# EAGLE design Testeur_new (EAGLE 6.1)
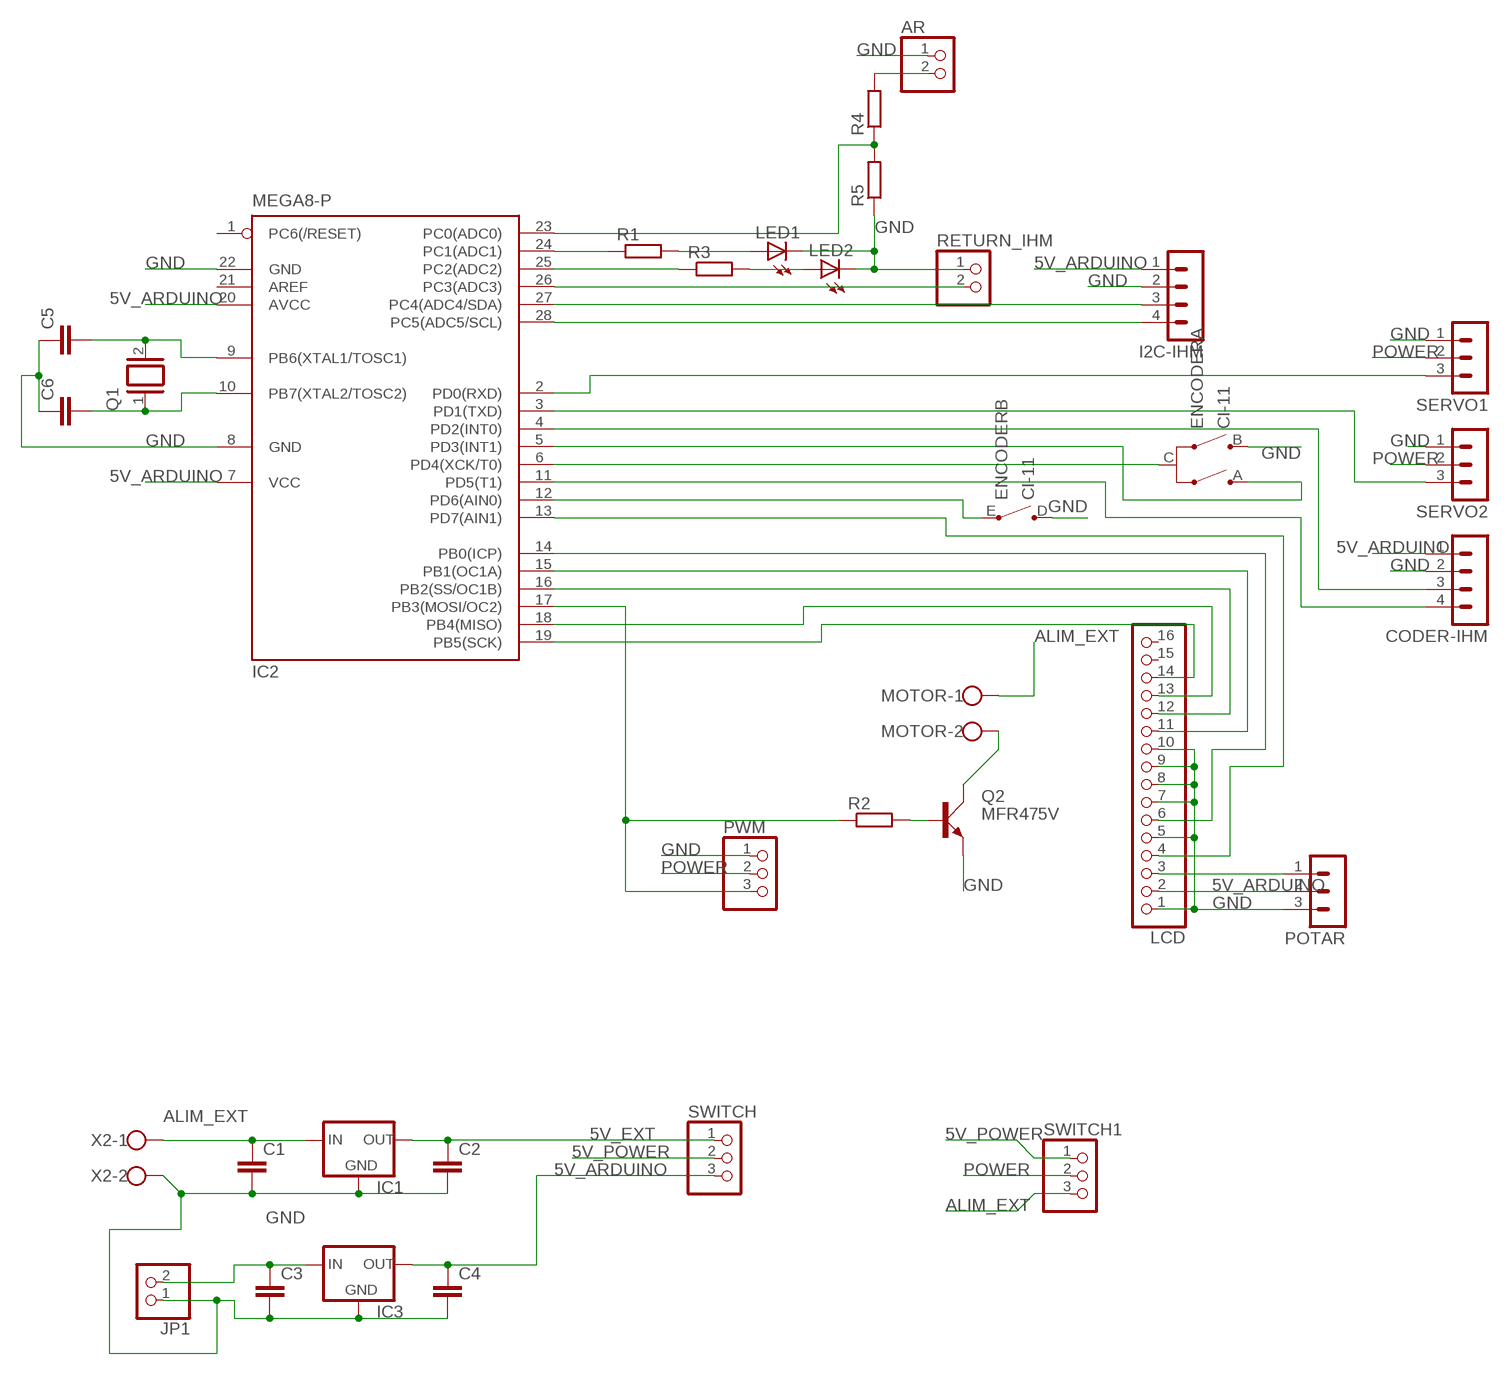
[diagram p0: schematic, sheet 1]

## Parts
AR  PINHD-1X2  [1X02]
C1  C5/3.5  [C5B3.5]
C2  C5/3.5  [C5B3.5]
C3  C5/3.5  [C5B3.5]
C4  C5/3.5  [C5B3.5]
C5  C5/5  [C5B5]
C6  C5/5  [C5B5]
CODER-IHM  MA04-1  [MA04-1]
ENCODER  CI-11  [CI-11]
I2C-IHM  MA04-1  [MA04-1]
IC1  78XXS  [78XXS]
IC2  MEGA8-P  [DIL28-3]
IC3  78XXS  [78XXS]
JP1  PINHD-1X2  [1X02]
LCD  PINHD-1X16  [1X16]
LED1  LED5MM  [LED5MM]
LED2  LED5MM  [LED5MM]
MOTOR  W237-102  [W237-102]
POTAR  MA03-1  [MA03-1]
PWM  PINHD-1X3  [1X03]
Q1  XTAL/S  [QS]
Q2  MFR475V  [TO220AV]
R1  R-EU_0204/7  [0204/7]
R2  R-EU_0204/7  [0204/7]
R3  R-EU_0204/7  [0204/7]
R4  R-EU_0204/7  [0204/7]
R5  R-EU_0204/7  [0204/7]
RETURN_IHM  PINHD-1X2  [1X02]
SERVO1  MA03-1  [MA03-1]
SERVO2  MA03-1  [MA03-1]
SWITCH  PINHD-1X3  [1X03]
SWITCH1  PINHD-1X3  [1X03]
X2  W237-102  [W237-102]

## Nets
5V_ARDUINO: C4.1 CODER-IHM.1 I2C-IHM.1 IC2.7(VCC) IC2.20(AVCC) IC3.OUT LCD.2 POTAR.2 SWITCH.3
5V_EXT: C2.1 IC1.OUT SWITCH.1
5V_POWER: SWITCH1.1 SWITCH.2
ALIM_EXT: C1.1 IC1.IN MOTOR.1 SWITCH1.3 X2.1
GND: AR.1 C1.2 C2.2 C3.2 C4.2 C5.1 C6.1 CODER-IHM.2 ENCODER.B(A:B) ENCODER.D(B:D) I2C-IHM.2 IC1.GND IC2.8(GND) IC2.22(GND) IC3.GND JP1.1 LCD.1 LCD.5 LCD.7 LCD.8 LCD.9 LCD.10 LED1.K(C) LED2.K(C) POTAR.3 PWM.1 Q2.E R5.1 RETURN_IHM.1 SERVO1.1 SERVO2.1 X2.2
N$1: IC2.26(PC3(ADC3)) RETURN_IHM.2
N$2: IC2.15(PB1(OC1A)) LCD.11
N$3: IC2.16(PB2(SS/OC1B)) LCD.12
N$4: IC2.18(PB4(MISO)) LCD.13
N$5: ENCODER.C(A:C) IC2.6(PD4(XCK/T0))
N$6: IC2.19(PB5(SCK)) LCD.14
N$8: Q2.B R2.2
N$9: LED2.A R3.2
N$10: I2C-IHM.3 IC2.27(PC4(ADC4/SDA))
N$11: I2C-IHM.4 IC2.28(PC5(ADC5/SCL))
N$12: LED1.A R1.2
N$13: ENCODER.E(B:E) IC2.12(PD6(AIN0))
N$14: IC2.2(PD0(RXD)) SERVO1.3
N$15: C3.1 IC3.IN JP1.2
N$16: CODER-IHM.3 IC2.4(PD2(INT0))
N$17: CODER-IHM.4 IC2.11(PD5(T1))
N$18: ENCODER.A(A:A) IC2.5(PD3(INT1))
N$21: IC2.24(PC1(ADC1)) R1.1
N$22: IC2.25(PC2(ADC2)) R3.1
N$24: AR.2 R4.2
N$25: IC2.13(PD7(AIN1)) LCD.4
N$26: IC2.14(PB0(ICP)) LCD.6
N$27: C6.2 IC2.10(PB7(XTAL2/TOSC2)) Q1.1
N$28: C5.2 IC2.9(PB6(XTAL1/TOSC1)) Q1.2
N$30: IC2.17(PB3(MOSI/OC2)) PWM.3 R2.1
N$37: R4.1 R5.2
N$39: LCD.3 POTAR.1
N$40: MOTOR.2 Q2.C
N$42: IC2.3(PD1(TXD)) SERVO2.3
POWER: PWM.2 SERVO1.2 SERVO2.2 SWITCH1.2
Unconnected: IC2.1(PC6(/RESET)) IC2.21(AREF) IC2.23(PC0(ADC0)) LCD.15 LCD.16

## Library data of the parts
AR JP1 RETURN_IHM = pinhead:PINHD-1X2: PIN HEADER
C1-C6 = capacitor-wima:C: CAPACITOR naming: grid - package width
CODER-IHM I2C-IHM = con-lstb:MA04-1: PIN HEADER; OC_FARNELL: unknown; OC_NEWARK: unknown
ENCODER = piher:CI-11: 11mm Incemental Encoder Source: www.piher.net .. 04-CI-11v04.pdf; OC_FARNELL: unknown; OC_NEWARK: unknown
IC1 IC3 = v-reg:78XXS: VOLTAGE REGULATOR
IC2 = atmel:MEGA8-P: MICROCONTROLLER 8 Kbytes FLASH, 1 kbytes SRAM, 512 bytes EEPROM, USART, 4-channel 10 bit ADC, 2-channel 8 bit ADC Pin compatible with Atmega48, ATMega88, ATMega168 Source: avr.lbr; OC_FARNELL: unknown; OC_NEWARK: unknown
LCD = pinhead:PINHD-1X16: PIN HEADER
LED1 LED2 = led:LED: LED OSRAM: - CHIPLED LG R971, LG N971, LY N971, LG Q971, LY Q971, LO R971, LY R971 LH N974, LH R974 LS Q976, LO Q976, LY Q976 LO Q996 - Hyper CHIPLED LW Q18S LB Q993, LB Q99A, LB R99A - SideLED LS A670, LO A670, LY A670, LG A670, LP A670 LB A673, LV A673, LT A673, LW A673 LH A674 LY A675 LS A676, LA A676, LO A676, LY A676, LW A676 LS A679, LY A679, LG A679 - Hyper Micro SIDELED® LS Y876, LA Y876, LO Y876, LY Y876 LT Y87S - SmartLED LW L88C, LW L88S LB L89C, LB L89S, LG L890 LS L89K, LO L89K, LY L89K LS L896, LA L896, LO L896, LY L896 - TOPLED LS T670, LO T670, LY T670, LG T670, LP T670 LSG T670, LSP T670, LSY T670, LOP T670, LYG T670 LG T671, LOG T671, LSG T671 LB T673, LV T673, LT T673, LW T673 LH T674 LS T676, LA T676, LO T676, LY T676, LB T676, LH T676, LSB T676, LW T676 LB T67C, LV T67C, LT T67C, LS T67K, LO T67K, LY T67K, LW E67C LS E67B, LA E67B, LO E67B, LY E67B, LB E67C, LV E67C, LT E67C LW T67C LS T679, LY T679, LG T679 LS T770, LO T770, LY T770, LG T770, LP T770 LB T773, LV T773, LT T773, LW T773 LH T774 LS E675, LA E675, LY E675, LS T675 LS T776, LA T776, LO T776, LY T776, LB T776 LHGB T686 LT T68C, LB T68C - Hyper Mini TOPLED® LB M676 - Mini TOPLED Santana® LG M470 LS M47K, LO M47K, LY M47K Source: http://www.osram.convergy.de LUXEON: - LUMILED® LXK2-PW12-R00, LXK2-PW12-S00, LXK2-PW14-U00, LXK2-PW14-V00 LXK2-PM12-R00, LXK2-PM12-S00, LXK2-PM14-U00 LXK2-PE12-Q00, LXK2-PE12-R00, LXK2-PE12-S00, LXK2-PE14-T00, LXK2-PE14-U00 LXK2-PB12-K00, LXK2-PB12-L00, LXK2-PB12-M00, LXK2-PB14-N00, LXK2-PB14-P00, LXK2-PB14-Q00 LXK2-PR12-L00, LXK2-PR12-M00, LXK2-PR14-Q00, LXK2-PR14-R00 LXK2-PD12-Q00, LXK2-PD12-R00, LXK2-PD12-S00 LXK2-PH12-R00, LXK2-PH12-S00 LXK2-PL12-P00, LXK2-PL12-Q00, LXK2-PL12-R00 Source: www.luxeon.com KINGBRIGHT: KA-3528ASYC Source: www.kingbright.com
MOTOR X2 = con-wago-500:W237-102: WAGO SCREW CLAMP; MPN: 237-102; OC_FARNELL: unknown; OC_NEWARK: 70K9898
POTAR SERVO1 SERVO2 = con-lstb:MA03-1: PIN HEADER; OC_FARNELL: unknown; OC_NEWARK: unknown
PWM SWITCH SWITCH1 = pinhead:PINHD-1X3: PIN HEADER
Q1 = special:XTAL/S: CRYSTAL
Q2 = transistor-power:MFR4*: NPN RF Power Transistor Source: Motorola - MRF475.pdf
R1 R3-R5 = rcl:R-EU_: RESISTOR, European symbol
R2 = resistor:R-EU_: RESISTOR, European symbol

## Board
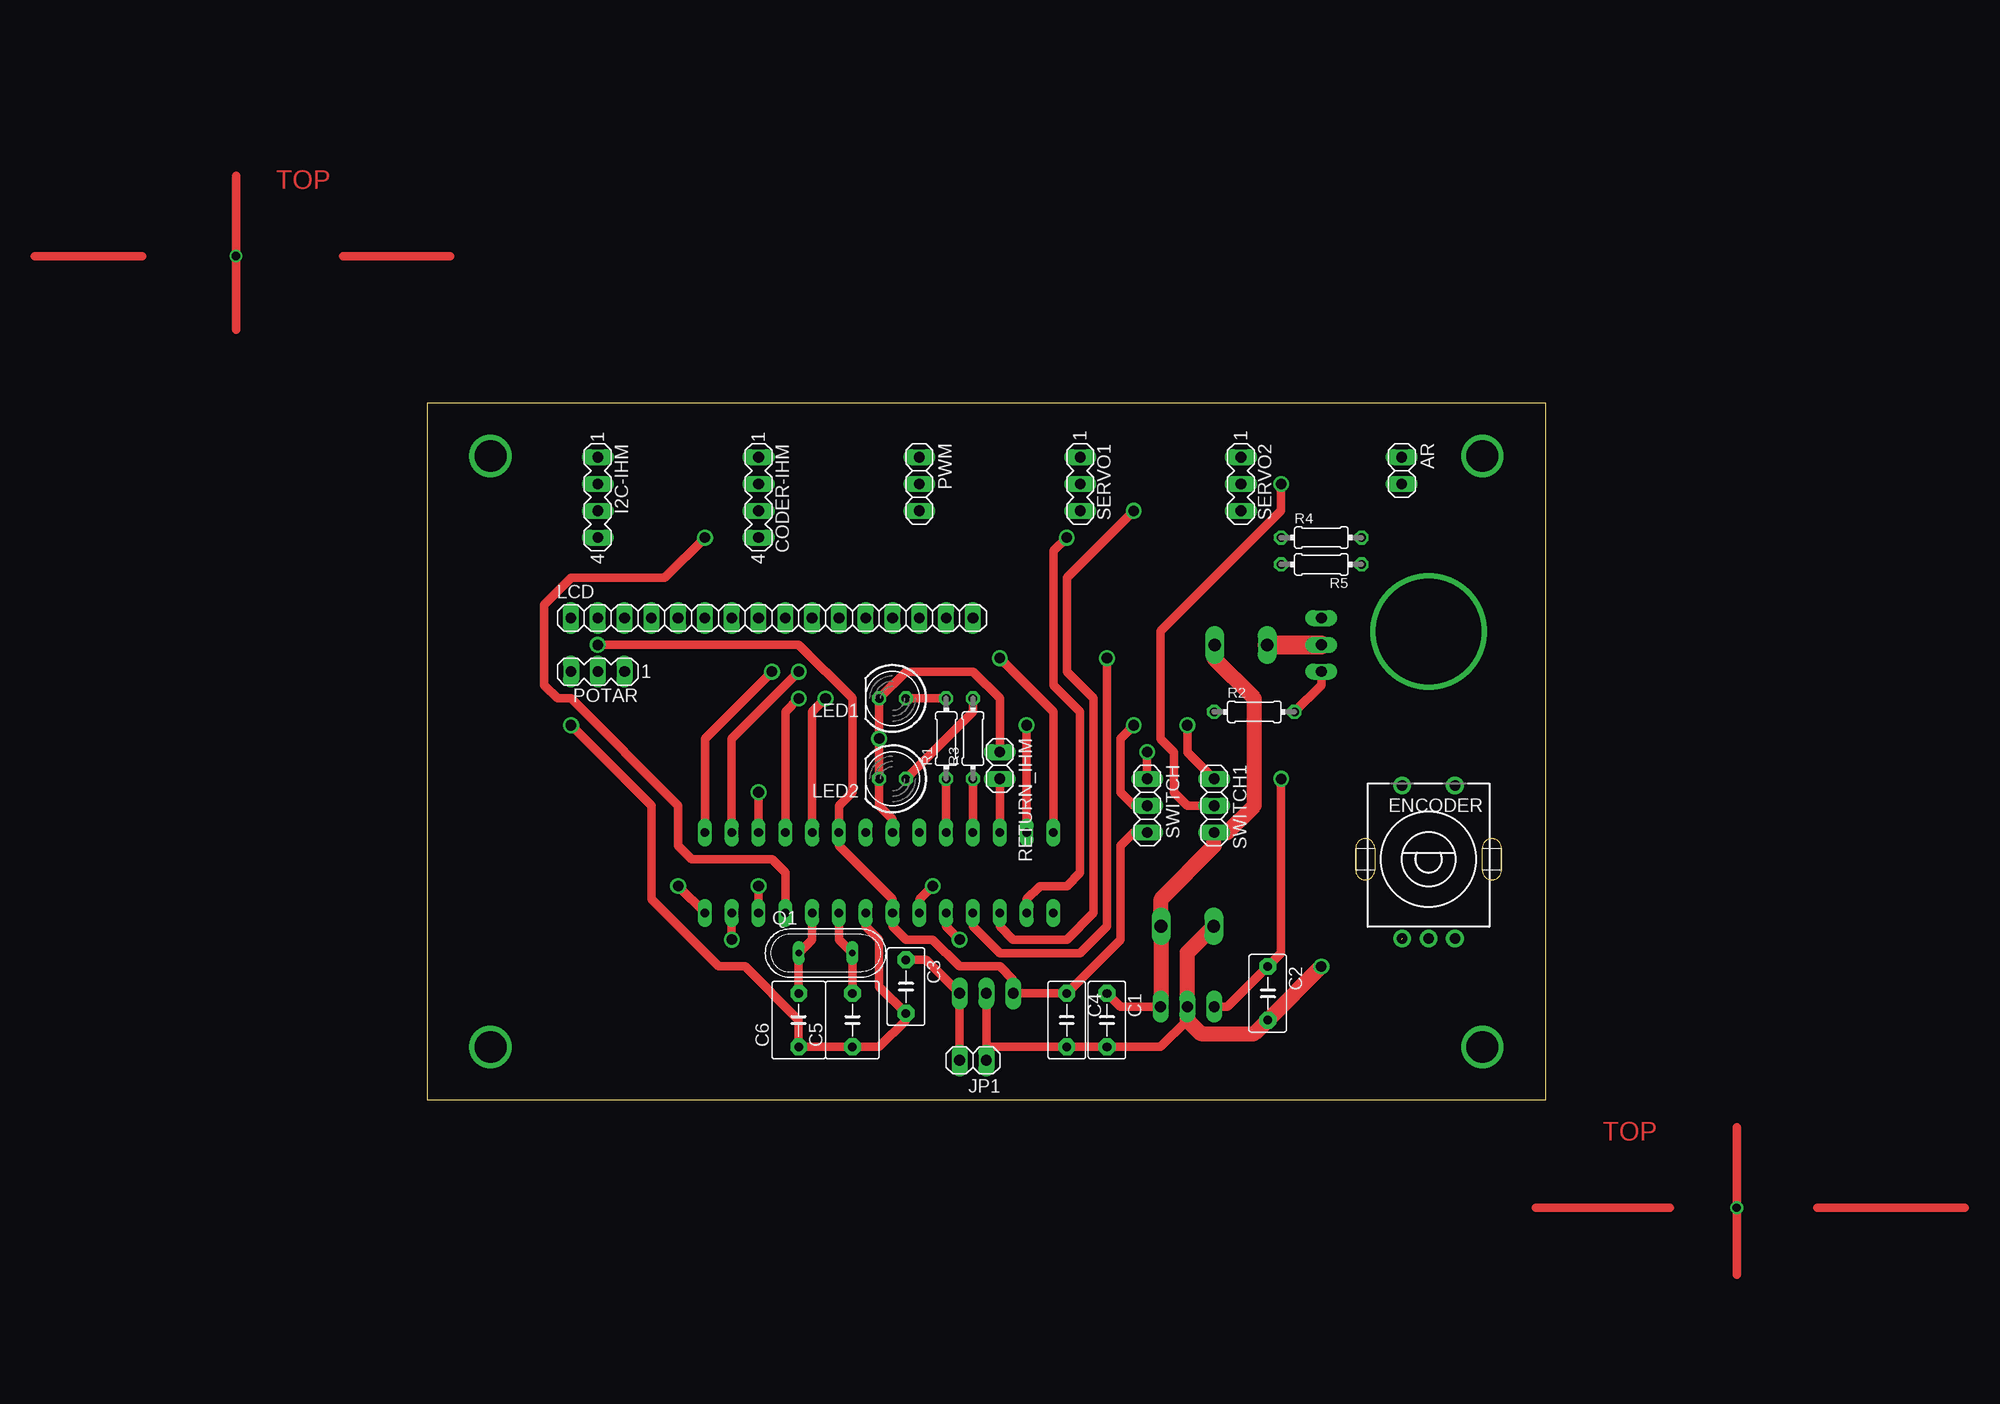
[diagram p1: board, top side]
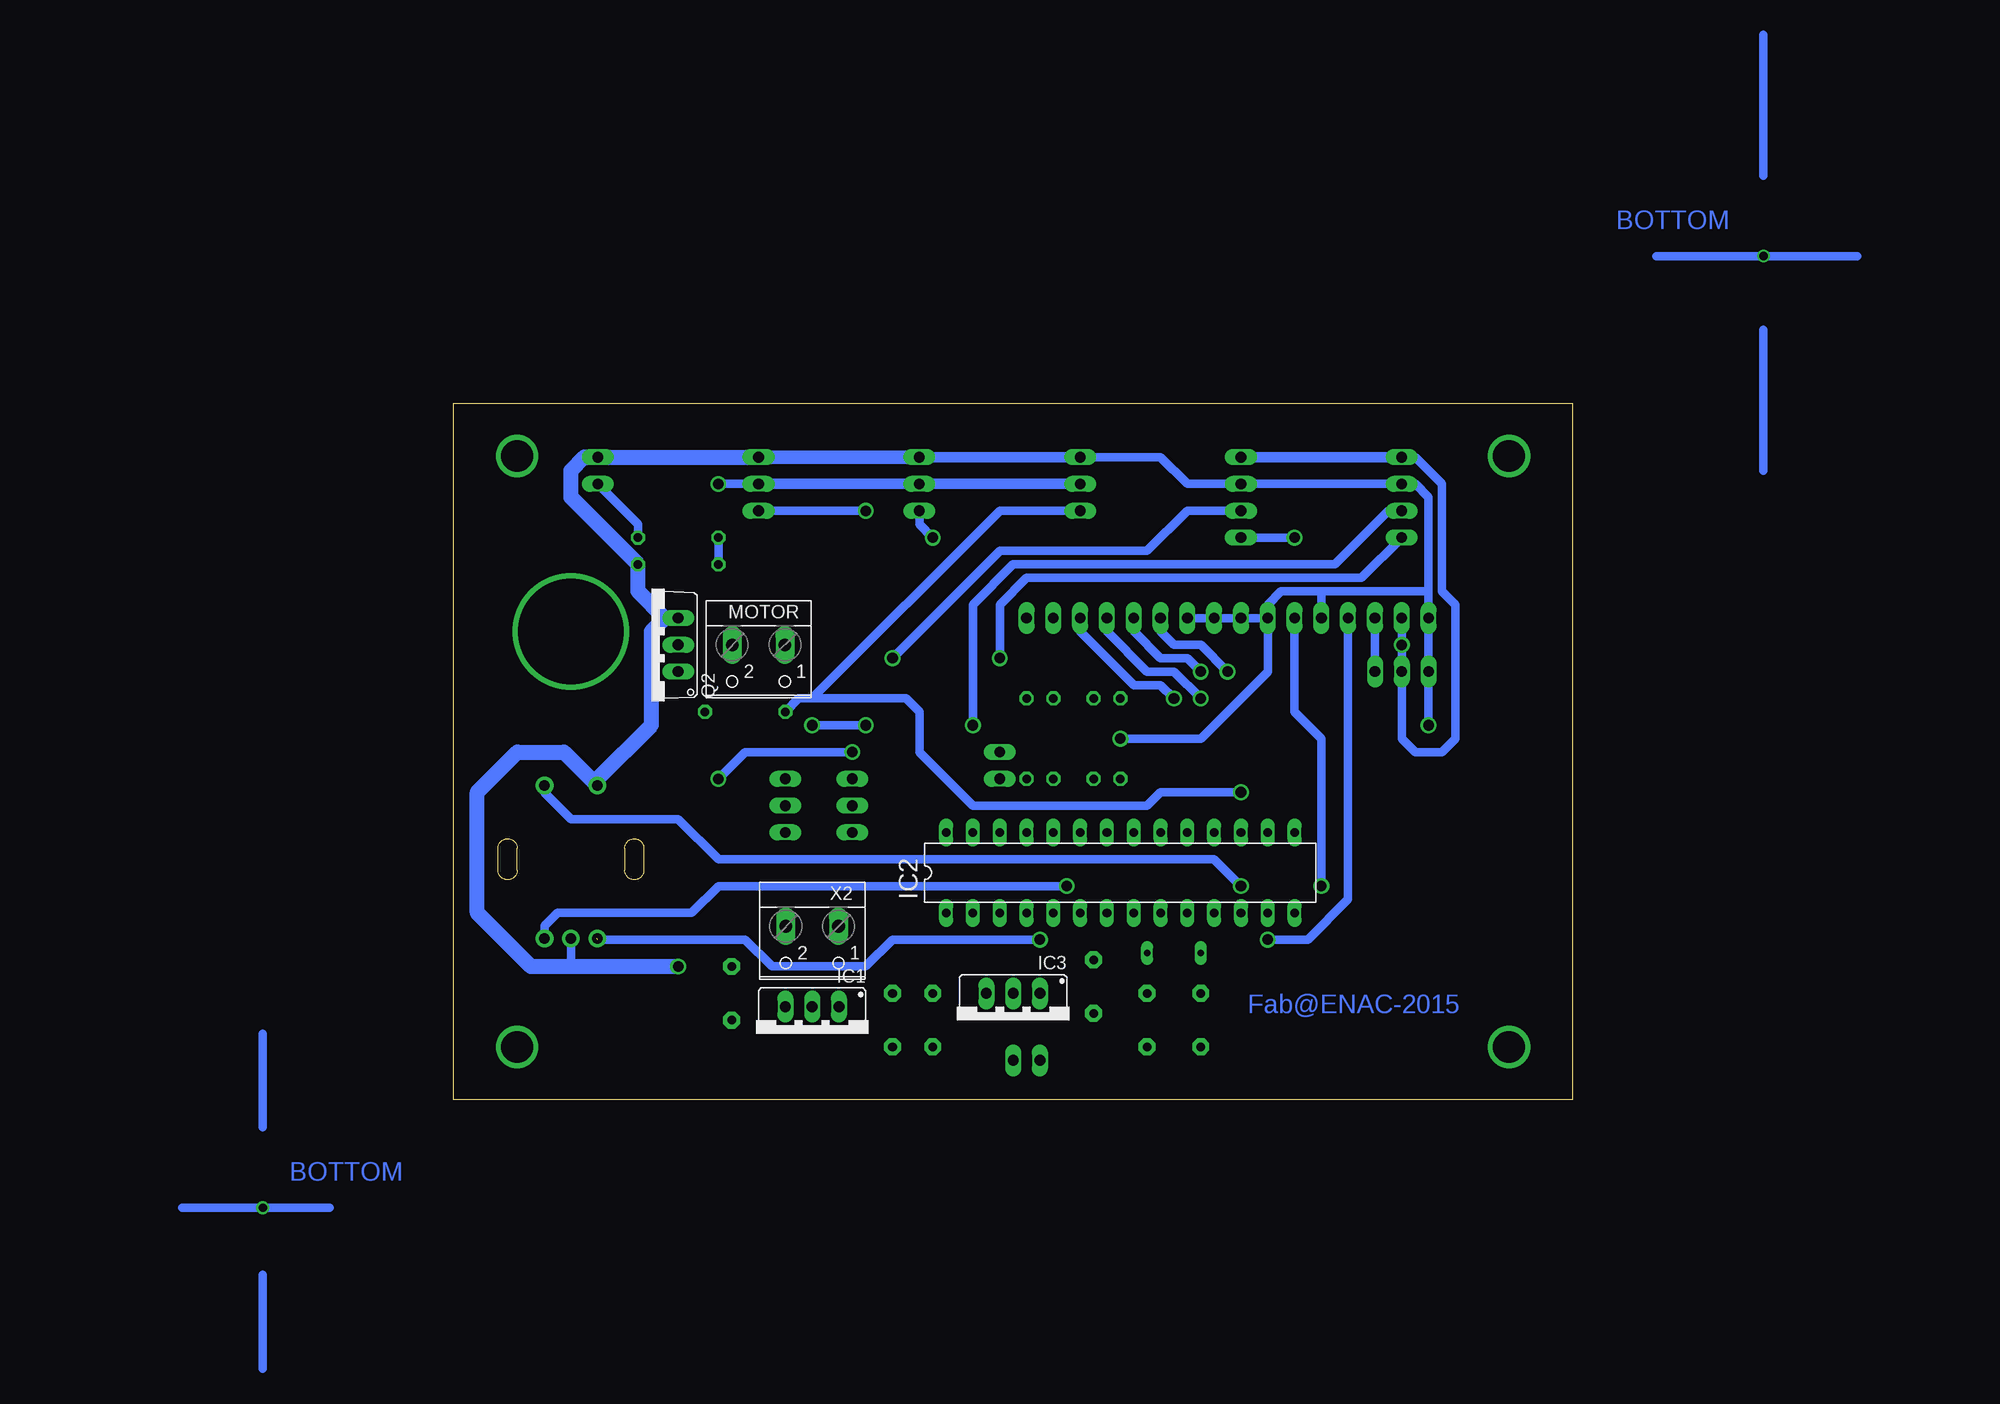
[diagram p2: board, bottom side, seen from below]

Size 106 x 66 mm. Coordinates in mm from the lower left corner, seen from the top.
Outline: 0,0 106,0 106,66 0,66 0,0
Copper layers (1*16): Top 0.035mm / dielectric 1.5mm / Bottom 0.035mm
Design rules: minimum track width 10mil, minimum drill 24mil, track to track 8mil, track to pad 8mil, pad to pad 8mil, via to via 8mil, smd to smd 8mil, copper to edge 40mil, drill to drill 8mil, minimum pad ring 10mil, minimum via ring 8mil, stop-mask expansion 4mil, vias tented up to drill 0mil, thermal gap 10mil

### Footprints (pad centres in the part's own frame; a part is rotated, then mirrored left to right if it is on the bottom)
1X02 = drill 1.016 long: 1 -1.27,0; 2 1.27,0
C5B3.5 = drill 0.813 pad 1.6 octagon: 1 -2.54,0; 2 2.54,0
C5B5 = drill 0.813 pad 1.6 octagon: 1 -2.54,0; 2 2.54,0
MA04-1 = drill 1.016 long: 1 -3.81,0; 2 -1.27,0; 3 1.27,0; 4 3.81,0
CI-11 = drill 1 pad 1.676: A -2.5,-7.5; B 0,-7.5; C 2.5,-7.5; D -2.5,7; E 2.5,7
78XXS = drill 1.016 long: GND 0,-2.54; IN -2.54,-2.54; OUT 2.54,-2.54
DIL28-3 = drill 0.813 long: 1 -16.51,-3.81; 2 -13.97,-3.81; 3 -11.43,-3.81; 4 -8.89,-3.81; 5 -6.35,-3.81; 6 -3.81,-3.81; 7 -1.27,-3.81; 8 1.27,-3.81; 9 3.81,-3.81; 10 6.35,-3.81; 11 8.89,-3.81; 12 11.43,-3.81; 13 13.97,-3.81; 14 16.51,-3.81; 15 16.51,3.81; 16 13.97,3.81; 17 11.43,3.81; 18 8.89,3.81; 19 6.35,3.81; 20 3.81,3.81; 21 1.27,3.81; 22 -1.27,3.81; 23 -3.81,3.81; 24 -6.35,3.81; 25 -8.89,3.81; 26 -11.43,3.81; 27 -13.97,3.81; 28 -16.51,3.81
1X16 = drill 1.016 long: 1 -19.05,0; 2 -16.51,0; 3 -13.97,0; 4 -11.43,0; 5 -8.89,0; 6 -6.35,0; 7 -3.81,0; 8 -1.27,0; 9 1.27,0; 10 3.81,0; 11 6.35,0; 12 8.89,0; 13 11.43,0; 14 13.97,0; 15 16.51,0; 16 19.05,0
LED5MM = drill 0.813 octagon: A -1.27,0; K 1.27,0
W237-102 = drill 1.194 long: 1 -2.5,-1.27; 2 2.5,-1.27
MA03-1 = drill 1.016 long: 1 -2.54,0; 2 0,0; 3 2.54,0
1X03 = drill 1.016 long: 1 -2.54,0; 2 0,0; 3 2.54,0
QS = drill 0.61 long: 1 -2.54,0; 2 2.54,0
TO220AV = drill 1.016 long: B -2.54,-2.54; C 0,-2.54; E 2.54,-2.54
0204/7 = drill 0.813 octagon: 1 -3.81,0; 2 3.81,0

### Placement (x,y rotation side)
AR  92.36,59.61 270 top
C1  64.42,7.54 270 top
C2  79.66,10.08 270 top
C3  45.37,10.71 270 top
C4  60.61,7.54 270 top
C5  40.29,7.54 90 top
C6  35.21,7.54 90 top
CODER-IHM  31.4,57.07 270 top
ENCODER  94.9,22.78 0 top
I2C-IHM  16.16,57.07 270 top
IC1  72.04,6.27 180 bottom
IC2  42.83,21.51 0 bottom
IC3  52.99,7.54 180 bottom
JP1  51.72,3.73 180 top
LCD  32.67,45.64 0 top
LED1  44.1,38.02 180 top
LED2  44.1,30.4 180 top
MOTOR  77.12,41.83 180 bottom
POTAR  16.16,40.56 180 top
PWM  46.64,58.34 270 top
Q1  37.75,13.89 0 top
Q2  87.28,43.1 90 bottom
R1  49.18,34.21 90 top
R2  78.39,36.75 0 top
R3  51.72,34.21 90 top
R4  84.74,53.26 0 top
R5  84.74,50.72 180 top
RETURN_IHM  54.26,31.67 270 top
SERVO1  61.88,58.34 270 top
SERVO2  77.12,58.34 270 top
SWITCH  68.23,27.86 270 top
SWITCH1  74.58,27.86 270 top
X2  72.04,15.16 180 bottom

### Tracks (layer width: path | path; a pad name or v marks a point on that pad's centre or on a via)
5V_ARDUINO  (via drill 1)
  Top 0.813: SWITCH.3 66.96,25.32 65.69,24.05 65.69,15.16 C4.1 IC3.OUT 55.53,11.35 54.26,12.62 50.45,12.62 47.91,15.16 45.37,15.16 44.1,16.43 IC2.7 44.1,18.97 39.02,24.05 IC2.20 39.02,27.86 40.29,29.13 40.29,38.02 35.21,43.1 v16.16,43.1
  Bottom 0.813: I2C-IHM.1 14.89,60.88 12.35,58.34 12.35,48.18 11.08,46.91 11.08,34.21 12.35,32.94 14.89,32.94 16.16,34.21 POTAR.2 v16.16,43.1 LCD.2
  Bottom 1.016: CODER-IHM.1 I2C-IHM.1
5V_EXT  (via drill 1)
  Top 0.813: IC1.OUT 75.85,8.81 C2.1 80.93,13.89 v80.93,30.4 | SWITCH.1 v68.23,32.94
  Bottom 0.813: v68.23,32.94 78.39,32.94 v80.93,30.4
5V_POWER  (via drill 1)
  Top 0.813: SWITCH.2 66.96,27.86 65.69,29.13 65.69,34.21 v66.96,35.48 | v72.04,35.48 72.04,32.94 SWITCH1.1
  Bottom 0.813: v66.96,35.48 v72.04,35.48
ALIM_EXT
  Top 0.813: C1.1 65.69,8.81 IC1.IN 69.54,8.85
  Top 1.422: 69.54,8.85 X2.1 69.54,19.01 74.58,24.05 SWITCH1.3 75.85,25.32 78.39,27.86 78.39,38.02 74.58,41.83 74.58,41.79 MOTOR.1
GND  (via drill 1)
  Top 0.813: IC2.22 44.1,26.59 42.83,27.86 LED2.K v42.83,34.21 LED1.K 45.37,40.56 51.72,40.56 54.26,38.02 RETURN_IHM.1 | IC2.8 41.56,16.43 42.83,15.16 42.83,10.71 C3.2 45.37,7.54 42.83,5 C5.1 C6.1 35.21,7.54 30.13,12.62 27.59,12.62 21.24,18.97 21.24,27.86 v13.62,35.48 | JP1.1 52.99,5 | 52.99,5 IC3.GND | 72.04,7.54 69.5,5 C1.2 C4.2 52.99,5
  Top 1.422: X2.2 72.04,13.93 IC1.GND 72.04,7.54 73.31,6.27 78.39,6.27 C2.2 v84.74,12.62
  Bottom 0.813: PWM.1 39.02,60.88 36.48,58.34 CODER-IHM.2 I2C-IHM.2 14.89,58.34 13.62,57.07 13.62,48.18 | 13.62,48.18 LCD.1 POTAR.3 v13.62,35.48 | LCD.5 23.78,48.18 | 23.78,48.18 13.62,48.18 | LCD.7 28.86,46.91 27.59,48.18 23.78,48.18 | LCD.7 LCD.8 LCD.9 LCD.10 | v42.83,34.21 35.21,34.21 28.86,40.56 LCD.7 | ENCODER.B 94.9,12.62
  Bottom 1.016: PWM.1 SERVO1.1
  Bottom 1.27: SERVO2.1 SERVO1.1 | ENCODER.D 92.4,30.36 | 86.01,45.64 Q2.E
  Bottom 1.422: SERVO2.1 AR.1 93.63,60.88 94.9,59.61 94.9,57.07 R5.1 88.55,48.18 86.01,45.64 87.28,44.37 87.28,35.48 92.4,30.36 | ENCODER.D 95.56,32.94 99.98,32.94 103.79,29.13 103.79,17.7 98.71,12.62 94.9,12.62 v84.74,12.62
N$1
  Top 0.813: IC2.26 RETURN_IHM.2
N$2  (via drill 1)
  Top 0.813: IC2.15 26.32,34.21 v32.67,40.56
  Bottom 0.813: LCD.11 39.02,44.37 37.75,43.1 35.21,43.1 v32.67,40.56
N$3  (via drill 1)
  Top 0.813: IC2.16 28.86,34.21 v35.21,40.56
  Bottom 0.813: v35.21,40.56 36.48,41.83 39.02,41.83 41.56,44.37 LCD.12
N$4  (via drill 1)
  Top 0.813: IC2.18 33.94,36.75 v35.21,38.02
  Bottom 0.813: v35.21,38.02 37.75,40.56 40.29,40.56 44.1,44.37 LCD.13
N$5  (via drill 1)
  Top 0.813: IC2.6 46.64,18.97 v47.91,20.24
  Bottom 0.813: v47.91,20.24 80.93,20.24 83.47,17.7 96.17,17.7 97.4,16.47 ENCODER.C
N$6  (via drill 1)
  Top 0.813: IC2.19 36.48,36.75 v37.75,38.02
  Bottom 0.813: v37.75,38.02 39.02,39.29 41.56,39.29 46.64,44.37 LCD.14
N$7  (via drill 3)
  other vias: 6,5
N$8
  Top 0.813: R2.2 84.74,39.29 Q2.B
N$9
  Top 0.813: LED2.A 51.72,36.75 R3.2
N$10  (via drill 1)
  Top 0.813: IC2.27 v56.8,35.48
  Bottom 0.813: v56.8,35.48 56.8,46.91 52.99,50.72 22.51,50.72 17.43,55.8 I2C-IHM.3
N$11  (via drill 1)
  Top 0.813: v54.26,41.83 59.34,36.75 IC2.28
  Bottom 0.813: v54.26,41.83 54.26,46.91 51.72,49.45 19.97,49.45 I2C-IHM.4
N$12
  Top 0.813: LED1.A R1.2
N$13  (via drill 1)
  Top 0.813: IC2.12 v31.4,20.24
  Bottom 0.813: v31.4,20.24 33.94,22.78 80.93,22.78 84.74,26.59 94.9,26.59 97.4,29.09 ENCODER.E
N$14  (via drill 1)
  Top 0.813: IC2.2 56.8,18.97 58.07,20.24 60.61,20.24 61.88,21.51 61.88,36.75 59.34,39.29 59.34,51.99 v60.61,53.26
  Bottom 0.813: v60.61,53.26 61.88,54.53 SERVO1.3
N$15
  Top 0.813: JP1.2 IC3.IN 47.27,13.26 C3.1
N$16  (via drill 1)
  Top 0.813: IC2.4 51.72,16.43 54.26,13.89 61.88,13.89 64.42,16.43 v64.42,41.83
  Bottom 0.813: v64.42,41.83 54.26,51.99 40.29,51.99 36.48,55.8 CODER-IHM.3
N$17  (via drill 1)
  Top 0.813: v26.32,53.26 22.51,49.45 13.62,49.45 11.08,46.91 11.08,39.29 12.35,38.02 13.62,38.02 23.78,27.86 23.78,24.05 25.05,22.78 32.67,22.78 33.94,21.51 IC2.11
  Bottom 0.813: v26.32,53.26 CODER-IHM.4
N$18  (via drill 1)  (1 unrouted)
  Top 0.813: IC2.5 49.18,16.43 v50.45,15.16
  Bottom 0.813: v50.45,15.16 64.42,15.16 66.96,12.62 75.85,12.62 78.39,15.16 92.36,15.16
N$19  (via drill 3)
  other vias: 6,61
N$20  (via drill 3)
  other vias: 100,5
N$21
  Top 0.813: IC2.24 R1.1
N$22
  Top 0.813: IC2.25 R3.1
N$23  (via drill 3)
  other vias: 100,61
N$24
  Bottom 0.813: R4.2 88.55,54.53 AR.2
N$25  (via drill 1)
  Top 0.813: IC2.13 v28.86,15.16
  Bottom 0.813: LCD.4 21.24,18.97 25.05,15.16 v28.86,15.16
N$26  (via drill 1)
  Top 0.813: v23.78,20.24 IC2.14
  Bottom 0.813: v23.78,20.24 23.78,34.21 26.32,36.75 LCD.6
N$27
  Top 0.813: IC2.10 36.48,15.16 Q1.1 C6.2
N$28
  Top 0.813: IC2.9 39.02,15.16 Q1.2 C5.2
N$29  (via drill 10)
  other vias: 94.9,44.37
N$30  (via drill 1)
  Top 0.813: IC2.17 v31.4,29.13
  Bottom 0.813: v31.4,29.13 39.02,29.13 40.29,27.86 56.8,27.86 61.88,32.94 61.88,36.75 63.15,38.02 72.04,38.02 | 72.04,38.02 73.31,38.02 R2.1 | PWM.3 54.26,55.8 72.04,38.02
N$31
  Bottom 0.813: -18.13,100.89 -18.13,87.55
N$32  (via drill 0.8)
  Top 0.813: -18.13,87.55 v-18.13,79.93 -18.13,72.94
  Bottom 0.813: -27.02,79.93 v-18.13,79.93 -7.97,79.93
N$33
  Bottom 0.813: -18.13,72.94 -18.13,59.61
N$35
  Top 0.813: -7.97,79.93 2.19,79.93
N$36
  Top 0.813: -27.02,79.93 -37.18,79.93
N$37
  Bottom 0.813: R5.2 R4.1
N$38
  Top 0.813: 105.06,-10.24 117.76,-10.24
N$39
  Bottom 0.813: POTAR.1 LCD.3
N$40
  Top 1.778: MOTOR.2 Q2.C
N$41  (via drill 0.8)
  Top 0.813: 124.11,-2.62 v124.11,-10.24 124.11,-16.59
  Bottom 0.813: 117.76,-10.24 v124.11,-10.24 131.73,-10.24
N$42  (via drill 1)
  Top 0.813: IC2.3 54.26,16.43 55.53,15.16 60.61,15.16 63.15,17.7 63.15,38.02 60.61,40.56 60.61,49.45 v66.96,55.8
  Bottom 0.813: v66.96,55.8 SERVO2.3
N$43
  Top 0.813: 131.73,-10.24 145.7,-10.24
N$45
  Bottom 0.813: 124.11,-16.59 124.11,-25.48
N$46
  Bottom 0.813: 124.11,-2.62 124.11,6.27
POWER  (via drill 1)
  Top 0.813: SWITCH1.2 72.04,27.86 70.77,29.13 70.77,32.94 69.5,34.21 69.5,44.37 80.93,55.8 v80.93,58.34
  Bottom 0.813: v80.93,58.34 SERVO2.2
  Bottom 1.016: PWM.2 SERVO1.2 SERVO2.2

### Text on the board
Top: TOP | TOP
Bottom: BOTTOM | Fab@ENAC-2015 | BOTTOM